# Altium schematic sheet Moduł_zasilania.SchDoc
size A4
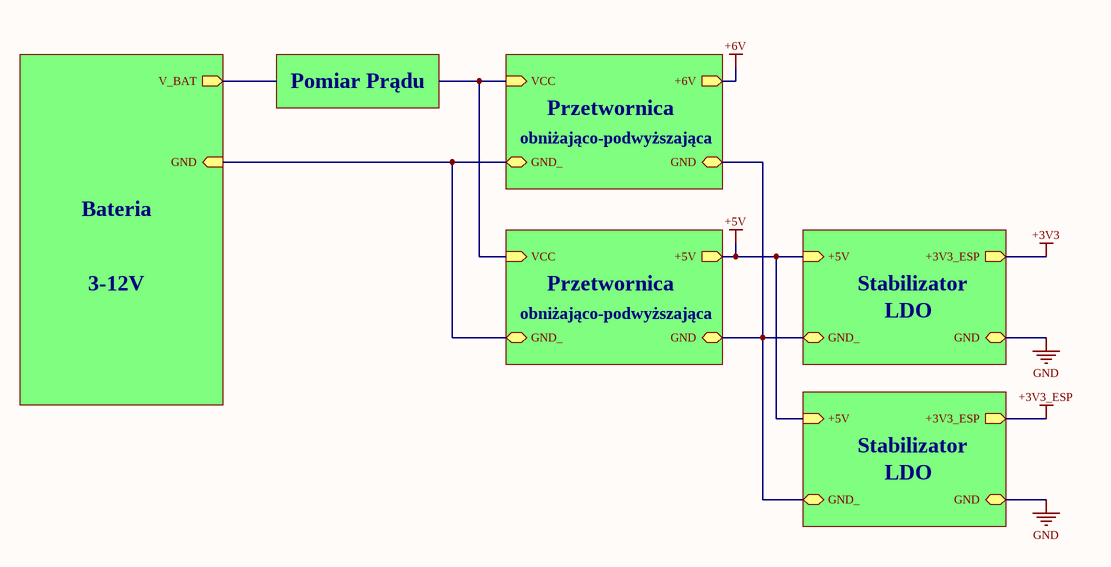
[diagram p0: Moduł_zasilania.SchDoc]

## Sub-sheets
U_Battery Charger = Battery Charger.SchDoc: GND (in), V_BAT (out)
U_Battery Charger = Battery Charger.SchDoc: VCC (in), GND_ (bidir), +6V (out), GND (bidir)
U_Battery Charger = Battery Charger.SchDoc: no entries
U_Battery Charger = Battery Charger.SchDoc: +5V (in), GND_ (bidir), +3V3_ESP (out), GND (bidir)
U_Battery Charger = Battery Charger.SchDoc: +5V (in), GND_ (bidir), +3V3_ESP (out), GND (bidir)
U_Battery Charger = Battery Charger.SchDoc: VCC (in), GND_ (bidir), +5V (out), GND (bidir)

## Nets
+3V3: sheet U_Battery Charger/+3V3_ESP
+3V3_ESP: sheet U_Battery Charger/+3V3_ESP
+5V: sheet U_Battery Charger/+5V, sheet U_Battery Charger/+5V, sheet U_Battery Charger/+5V
+6V: sheet U_Battery Charger/+6V
GND: sheet U_Battery Charger/GND, sheet U_Battery Charger/GND
(unnamed): sheet U_Battery Charger/GND, sheet U_Battery Charger/GND_, sheet U_Battery Charger/GND_
(unnamed): sheet U_Battery Charger/VCC, sheet U_Battery Charger/VCC
(unnamed): sheet U_Battery Charger/GND, sheet U_Battery Charger/GND_, sheet U_Battery Charger/GND_, sheet U_Battery Charger/GND

## Notes on the sheet
- Pomiar Prądu
- Przetwornica
- obniżająco-podwyższająca
- Bateria
- 3-12V
- Stabilizator
- LDO